# EAGLE design PIDDYBOT_V1 (EAGLE 7.1.0)
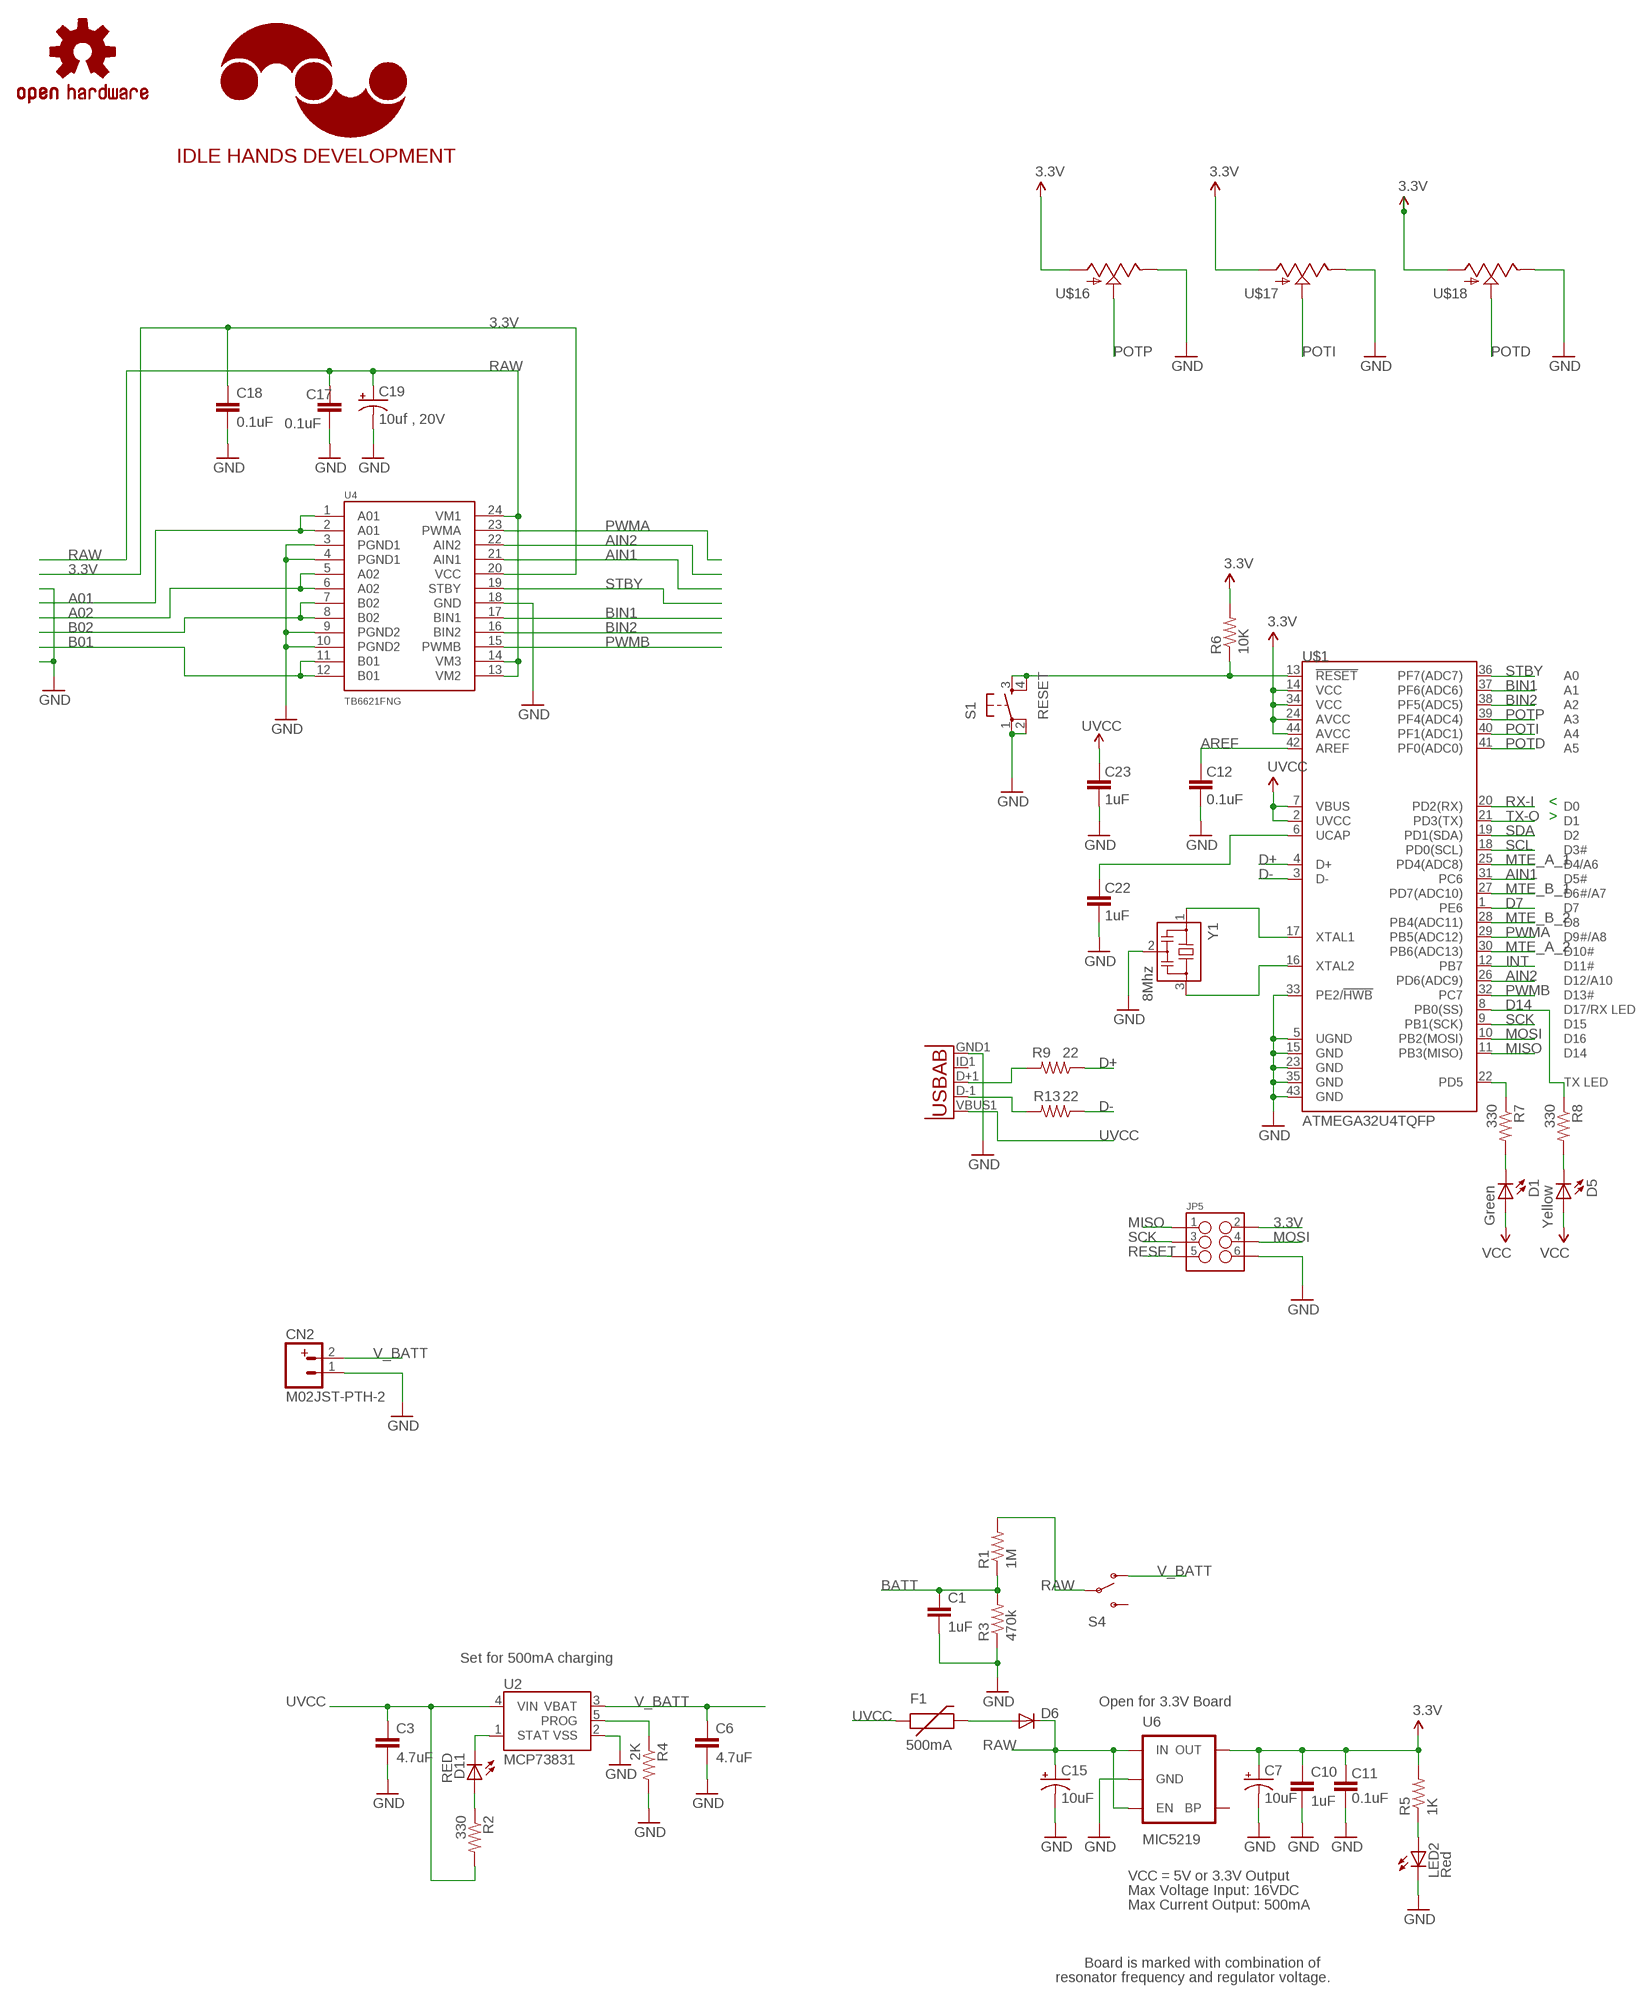
[diagram p0: schematic, sheet 1, part 1 of 2]
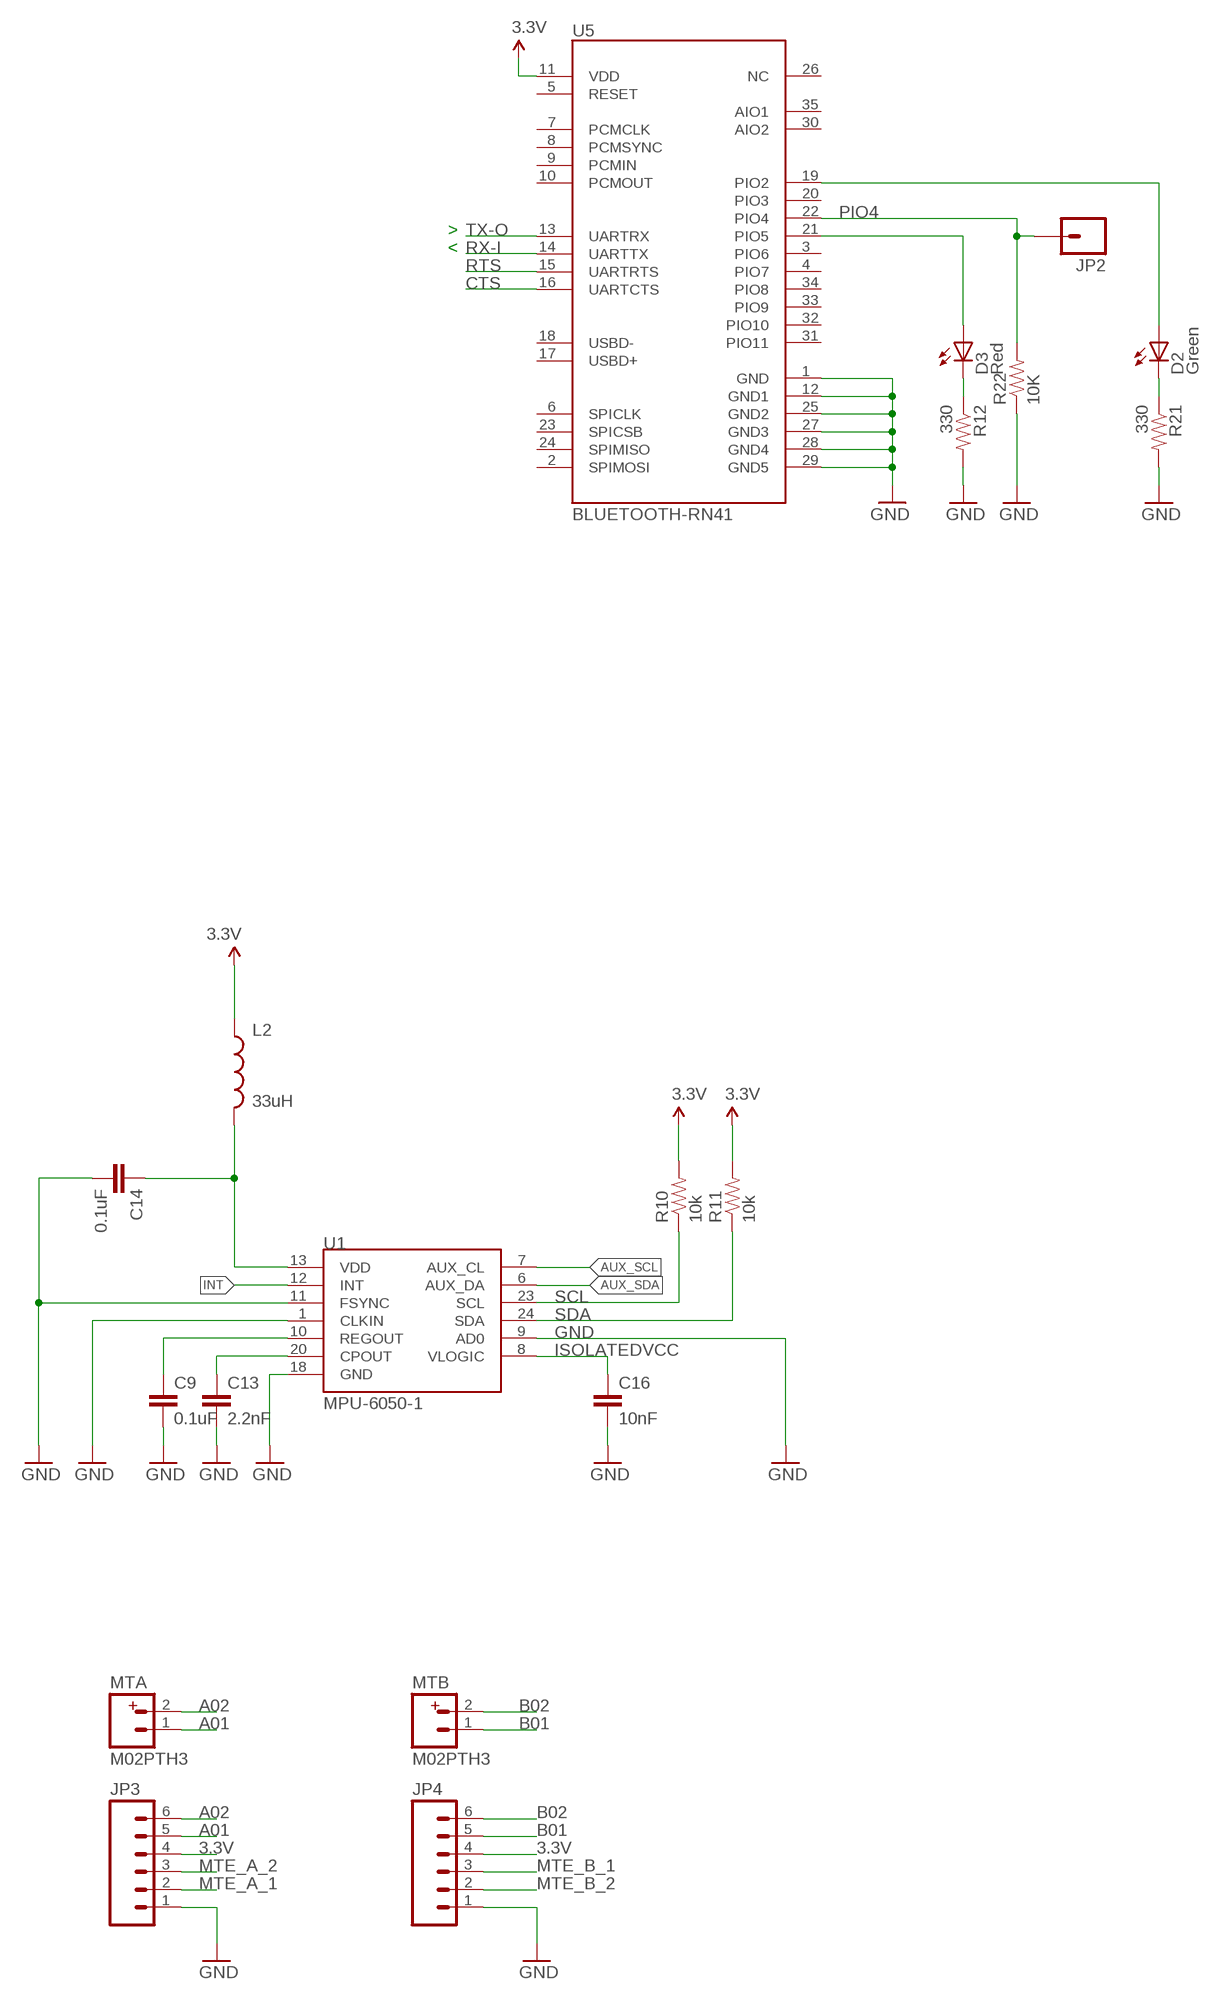
[diagram p1: schematic, sheet 1, part 2 of 2]

## Parts
C1  1uF  CAP0603-CAP  [0603-CAP]
C3  4.7uF  CAP0603-CAP  [0603-CAP]
C6  4.7uF  CAP0603-CAP  [0603-CAP]
C7  10uF  CAP_POL1206  [EIA3216]
C9  0.1uF  CAP0603-CAP  [0603-CAP]
C10  1uF  CAP0603-CAP  [0603-CAP]
C11  0.1uF  CAP0603-CAP  [0603-CAP]
C12  0.1uF  CAP0603-CAP  [0603-CAP]
C13  2.2nF  CAP0603-CAP  [0603-CAP]
C14  0.1uF  CAP0603-CAP  [0603-CAP]
C15  10uF  CAP_POL1206  [EIA3216]
C16  10nF  CAP0603-CAP  [0603-CAP]
C17  0.1uF  CAP0603-CAP  [0603-CAP]
C18  0.1uF  CAP0603-CAP  [0603-CAP]
C19  10uf , 20V  CAP_POL3528  [EIA3528]
C22  1uF  CAP0603-CAP  [0603-CAP]
C23  1uF  CAP0603-CAP  [0603-CAP]
CN2  M02JST-PTH-2  [JST-2-PTH]
D1  Green  LED0603  [LED-0603]
D2  Green  LED0603  [LED-0603]
D3  Red  LED0603  [LED-0603]
D5  Yellow  LED0603  [LED-0603]
D6  DIODESOD  [SOD-323]
D11  RED  LED0603  [LED-0603]
F1  500mA  PTCSMD  [PTC-1206]
JP2  M01SMDNS  [1X01NS]
JP3  M06SMD-1MM  [1X06-1MM]
JP4  M06SMD-1MM  [1X06-1MM]
JP5  M03X2NO_SILK  [2X3-NS]
L2  33uH  INDUCTOR0402  [C0402]
LED2  Red  LED0603  [LED-0603]
LOGO1  IDLEHANDS_LOGOL  [IHD-LOGO-L]
LOGO2  OSHW-LOGOM  [OSHW-LOGO-M]
MTA  M02PTH3  [1X02_LONGPADS]
MTB  M02PTH3  [1X02_LONGPADS]
R1  1M  RESISTOR0603-RES  [0603-RES]
R2  330  RESISTOR0603-RES  [0603-RES]
R3  470k  RESISTOR0603-RES  [0603-RES]
R4  2K  RESISTOR0603-RES  [0603-RES]
R5  1K  RESISTOR0603-RES  [0603-RES]
R6  10K  RESISTOR0603-RES  [0603-RES]
R7  330  RESISTOR0603-RES  [0603-RES]
R8  330  RESISTOR0603-RES  [0603-RES]
R9  22  RESISTOR0603-RES  [0603-RES]
R10  10k  RESISTOR0603-RES  [0603-RES]
R11  10k  RESISTOR0603-RES  [0603-RES]
R12  330  RESISTOR0603-RES  [0603-RES]
R13  22  RESISTOR0603-RES  [0603-RES]
R21  330  RESISTOR0603-RES  [0603-RES]
R22  10K  RESISTOR0603-RES  [0603-RES]
S1  RESET  TAC_SWITCHSMD  [TACTILE_SWITCH_SMD]
S4  SWITCH-SPDTPTH  [SWITCH-SPDT]
U1  MPU-6050-1  [QFN-24-4MM2]
U2  MCP73831  [SOT23-5]
U4  TB6621FNG  [SSOP24]
U5  BLUETOOTH-RN41  BLUETOOTH-RN41"  [RN41]
U6  MIC5219  V_REG_LDOSMD  [SOT23-5]
U$1  ATMEGA32U4TQFP  [SPARKFUN-DIGITALIC_TQFP44]
U$16  POT  [ALPS_POT]
U$17  POT  [ALPS_POT]
U$18  POT  [ALPS_POT]
X2  USB-ABIN&OUT  [USB-AB-MICRO-SMD-V03-IN&OUT]
Y1  8Mhz  CSTCR6M00G53Z  [CSTCR6M]

## Nets
3.3V: C7.A(+) C10.1 C11.2 C18.1 D1.A D5.A JP3.4 JP4.4 JP5.2 L2.1 R5.2 R6.2 R10.2 R11.2 U4.20(VCC) U5.11(VDD) U6.5(OUT) U$1.14(VCC) U$1.24(AVCC) U$1.34(VCC) U$1.44(AVCC) U$16.P$3(A) U$17.P$3(A) U$18.P$3(A) ; supply symbol labelled VCC
A01: JP3.5 MTA.1 U4.1(A01) U4.2(A01)
A02: JP3.6 MTA.2 U4.5(A02) U4.6(A02)
AIN1: U4.21(AIN1) U$1.31(PC6)
AIN2: U4.22(AIN2) U$1.26(PD6(ADC9))
AREF: C12.2 U$1.42(AREF)
AUX_SCL: U1.7(AUX_CL)
AUX_SDA: U1.6(AUX_DA)
B01: JP4.5 MTB.1 U4.11(B01) U4.12(B01)
B02: JP4.6 MTB.2 U4.7(B02) U4.8(B02)
BATT: C1.1 R1.1 R3.2
BIN1: U4.17(BIN1) U$1.37(PF6(ADC6))
BIN2: U4.16(BIN2) U$1.38(PF5(ADC5))
CTS: U5.16(UARTCTS)
D1: D3.C R12.1
D2: D2.C R21.1
D7: U$1.1(PE6)
D14: R8.1 U$1.8(PB0(SS))
D+: R9.1 U$1.4(D+)
D-: R13.1 U$1.3(D-)
GND [vcc]: C1.2 C3.2 C6.2 C7.C(-) C9.2 C10.2 C11.1 C12.1 C13.2 C14.2 C15.C(-) C16.2 C17.2 C18.2 C19.C(-) C22.1 C23.1 CN2.1 JP3.1 JP4.1 JP5.6 LED2.C R3.1 R4.2 R12.2 R21.2 R22.1 S1.1 S1.2 U1.1(CLKIN) U1.9(AD0) U1.11(FSYNC) U1.18(GND) U2.2(VSS) U4.3(PGND1) U4.4(PGND1) U4.9(PGND2) U4.10(PGND2) U4.18(GND) U5.1(GND) U5.12(GND1) U5.25(GND2) U5.27(GND3) U5.28(GND4) U5.29(GND5) U6.2(GND) U$1.5(UGND) U$1.15(GND) U$1.23(GND) U$1.33(PE2/!HWB) U$1.35(GND) U$1.43(GND) U$16.P$1(E) U$17.P$1(E) U$18.P$1(E) X2.GND1(GND) Y1.2
INT: U1.12(INT) U$1.12(PB7)
ISOLATEDVCC: C14.1 C16.1 L2.2 U1.8(VLOGIC) U1.13(VDD)
MISO: JP5.1 U$1.11(PB3(MISO))
MOSI: JP5.4 U$1.10(PB2(MOSI))
MTE_A_1: JP3.2 U$1.25(PD4(ADC8))
MTE_A_2: JP3.3 U$1.30(PB6(ADC13))
MTE_B_1: JP4.3 U$1.27(PD7(ADC10))
MTE_B_2: JP4.2 U$1.28(PB4(ADC11))
N$1: U$1.17(XTAL1) Y1.1
N$2: U$1.16(XTAL2) Y1.3
N$3: D6.2(A) F1.2
N$6: C13.1 U1.20(CPOUT)
N$7: C9.1 U1.10(REGOUT)
N$9: D3.A U5.21(PIO5)
N$11: D2.A U5.19(PIO2)
N$13: D11.A R2.1
N$15: C22.2 U$1.6(UCAP)
N$16: R13.2 X2.D-1(D-)
N$17: R9.2 X2.D+1(D+)
N$19: D5.C R8.2
N$20: D1.C R7.2
N$38: LED2.A R5.1
PIO4: JP2.1 R22.2 U5.22(PIO4)
POTD: U$1.41(PF0(ADC0)) U$18.P$2(S)
POTI: U$1.40(PF1(ADC1)) U$17.P$2(S)
POTP: U$1.39(PF4(ADC4)) U$16.P$2(S)
PROG: R4.1 U2.5(PROG)
PWMA: U4.23(PWMA) U$1.29(PB5(ADC12))
PWMB: U4.15(PWMB) U$1.32(PC7)
RAW: C15.A(+) C17.1 C19.A(+) D6.1(C) R1.2 S4.2(P) U4.13(VM2) U4.14(VM3) U4.24(VM1) U6.1(IN) U6.3(EN)
RESET: JP5.5 R6.1 S1.3 S1.4 U$1.13(!RESET)
RTS: U5.15(UARTRTS)
RX-I: U5.14(UARTTX) U$1.20(PD2(RX))
SCK: JP5.3 U$1.9(PB1(SCK))
SCL: R10.1 U1.23(SCL) U$1.18(PD0(SCL))
SDA: R11.1 U1.24(SDA) U$1.19(PD1(SDA))
STAT: D11.C U2.1(STAT)
STBY: U4.19(STBY) U$1.36(PF7(ADC7))
TX-O: U5.13(UARTRX) U$1.21(PD3(TX))
TXLED: R7.1 U$1.22(PD5)
UVCC: C3.1 C23.2 F1.1 R2.2 U2.4(VIN) U$1.2(UVCC) U$1.7(VBUS) X2.VBUS1(VBUS)
V_BATT: C6.1 CN2.2 S4.1(O) U2.3(VBAT)
Unconnected: S4.3(S) U5.2(SPIMOSI) U5.3(PIO6) U5.4(PIO7) U5.5(RESET) U5.6(SPICLK) U5.7(PCMCLK) U5.8(PCMSYNC) U5.9(PCMIN) U5.10(PCMOUT) U5.17(USBD+) U5.18(USBD-) U5.20(PIO3) U5.23(SPICSB) U5.24(SPIMISO) U5.26(NC) U5.30(AIO2) U5.31(PIO11) U5.32(PIO10) U5.33(PIO9) U5.34(PIO8) U5.35(AIO1) U6.4(BP) X2.ID1(USBID)

## Notes on the sheet
- >
- <
- <
- >
- Set for 500mA charging
- Open for 3.3V Board
- VCC = 5V or 3.3V Output
- Max Voltage Input: 16VDC
- Max Current Output: 500mA
- Board is marked with combination of
- resonator frequency and regulator voltage.

## Library data of the parts
C1 C3 C6 C9-C14 C16-C18 C22 C23 = SparkFun:CAP: Capacitor Standard 0603 ceramic capacitor, and 0.1" leaded capacitor.
C7 C15 C19 = SparkFun:CAP_POL: Capacitor Polarized These are standard SMD and PTH capacitors. Normally 10uF, 47uF, and 100uF in electrolytic and tantalum varieties. Always verify the external diameter of the through hole cap, it varies with capacity, voltage, and manufacturer. The EIA devices should be standard.
CN2 MTA MTB = SparkFun-Connectors:M02: Standard 2-pin 0.1" header. Use with - straight break away headers ( PRT-00116) - right angle break away headers (PRT-00553) - swiss pins (PRT-00743) - machine pins (PRT-00117) - female headers (PRT-00115) Molex polarized connector foot print use with: PRT-08233 with associated crimp pins and housings. 2.54_SCREWTERM for use with PRT-10571. 3.5mm Screw Terminal footprints for PRT-08084 5mm Screw Terminal footprints for use with PRT-08433
D1-D3 D5 D11 LED2 = SparkFun:LED: LEDs Standard schematic elements and footprints for 5mm, 3mm, 1206, and 0603 sized LEDs. 5mm - Spark Fun Electronics SKU : COM-00529 (and others)
D6 = SparkFun:DIODE: Diode These are standard reverse protection diodes and small signal diodes. SMA package can handle up to about 1A. SOD-323 can handle about 200mA. What the SOD-323 package when ordering, there are some mfgs out there that are 5-pin packages.
F1 = SparkFun:PTC: Resettable Fuse PTC Resettable Fuse. Spark Fun Electronics SKU : COM-08357
JP2 = SparkFun:M01: Header 1 Standard 1-pin 0.1" header. Use with straight break away headers (SKU : PRT-00116), right angle break away headers (PRT-00553), swiss pins (PRT-00743), machine pins (PRT-00117), and female headers (PRT-00115).
JP3 JP4 = SparkFun-Connectors:M06: Header 6 Standard 6-pin 0.1" header. Use with straight break away headers (SKU : PRT-00116), right angle break away headers (PRT-00553), swiss pins (PRT-00743), machine pins (PRT-00117), and female headers (PRT-00115). Molex polarized connector foot print use with SKU : PRT-08094 with associated crimp pins and housings. NOTES ON THE VARIANTS LOCK and LOCK_LONGPADS... This footprint was designed to help hold the alignment of a through-hole component (i.e. 6-pin header) while soldering it into place. You may notice that each hole has been shifted either up or down by 0.005 of an inch from it's more standard position (which is a perfectly straight line). This slight alteration caused the pins (the squares in the middle) to touch the edges of the holes. Because they are alternating, it causes a "brace" to hold the component in place. 0.005 has proven to be the perfect amount of "off-center" position when using our standard breakaway headers. Although looks a little odd when you look at the bare footprint, once you have a header in there, the alteration is very hard to notice. Also,if you push a header all the way into place, it is covered up entirely on the bottom side. This idea of altering the position of holes to aid alignment will be further integrated into the Sparkfun Library for other footprints. It can help hold any component with 3 or more connection pins.
JP5 = SparkFun-Connectors:M03X2: 2x3 .1" header. Shrouded, with keying- CONN-10681 SMT- CONN-11415 Pogo pins- HW-11044
L2 = SparkFun-Passives:INDUCTOR: Inductors Basic Inductor/Choke - 0603 and 1206. Footprints are not proven and vary greatly between part numbers. SRN6045- 33uH, 20% 1.4A SDR0403-560KL - 56uH, 10%, 500mA RMS/740mA peak
LOGO1 = IdleHandsProject:IDLEHANDS_LOGO: Open Source Hardware Logo This logo indicates the piece of hardware it is found on incorporates a OSHW license and/or adheres to the definition of open source hardware found here: http://freedomdefined.org/OSHW
LOGO2 = SparkFun-Aesthetics:OSHW-LOGO: Open Source Hardware Logo This logo indicates the piece of hardware it is found on incorporates a OSHW license and/or adheres to the definition of open source hardware found here: http://freedomdefined.org/OSHW
R1-R13 R21 R22 = SparkFun:RESISTOR: Resistor Basic schematic elements and footprints for 0603, 1206, and PTH resistors.
S1 = SparkFun:TAC_SWITCH: Momentary Switch Button commonly used for reset or general input. Spark Fun Electronics SKU : COM-00097
S4 = SparkFun-Electromechanical:SWITCH-SPDT: SPDT Switch Simple slide switch, Spark Fun Electronics SKU : COM-00102 DPDT SMT slide switch, AYZ0202, SWCH-08179
U1 = Testing:MPU-6050
U2 = SparkFun:MCP73831: Microchip's MCP73831 Miniature single cell, fully integrated Li-Ion, Li-polymer charge management controller http://ww1.microchip.com/downloads/en/DeviceDoc/21984a.pdf
U4 = SparkFun:TB6621FNG: Toshiba 1A motor driver
U5 = ScratchPad:BLUETOOTH-RN41
U6 = SparkFun:V_REG_LDO: Voltage Regulator LDO Standard 150mA LDO voltage regulator in SOT-23 layout. Micrel part MIC5205. BP (by-pass) pin is used to lower output noise with 470pF cap.
U$1 = SparkFun-DigitalIC:ATMEGA32U4: Atmel 44-pin 8-bit Microcontroller with 32KBytes of ISP Flash and USB Controller ----- Please use the QFN-44-NOPAD_1:1 package for the footprint of all boards using a 32U4. Route traces directly away from the pads as much as possible.
U$16-U$18 = SparkFun-Electromechanical:POT
X2 = Testing:USB-AB: This is a USB AB connector that is compatible with USB OTG. i.e. this connector can serve as a host or device
Y1 = murata-filter:CSTCR: Resonator Source: murata.co.jp; MPN: CSTCR6M00G53-R0; OC_FARNELL: 1170434; OC_NEWARK: 25M8759

## Net classes
0 default: width 0.203 mm
1 vcc: width 0.254 mm

## Board
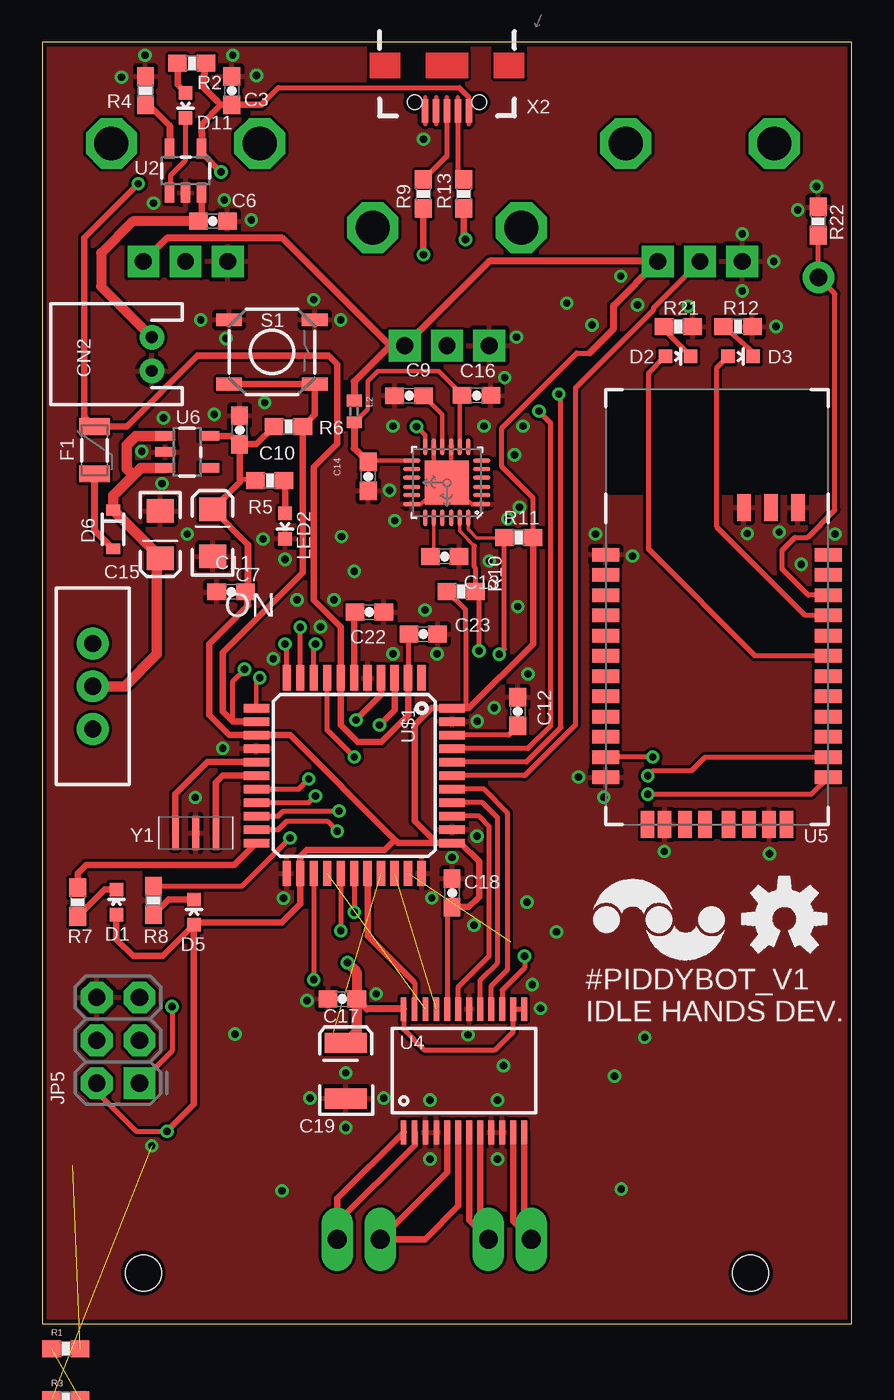
[diagram p2: board, top side]
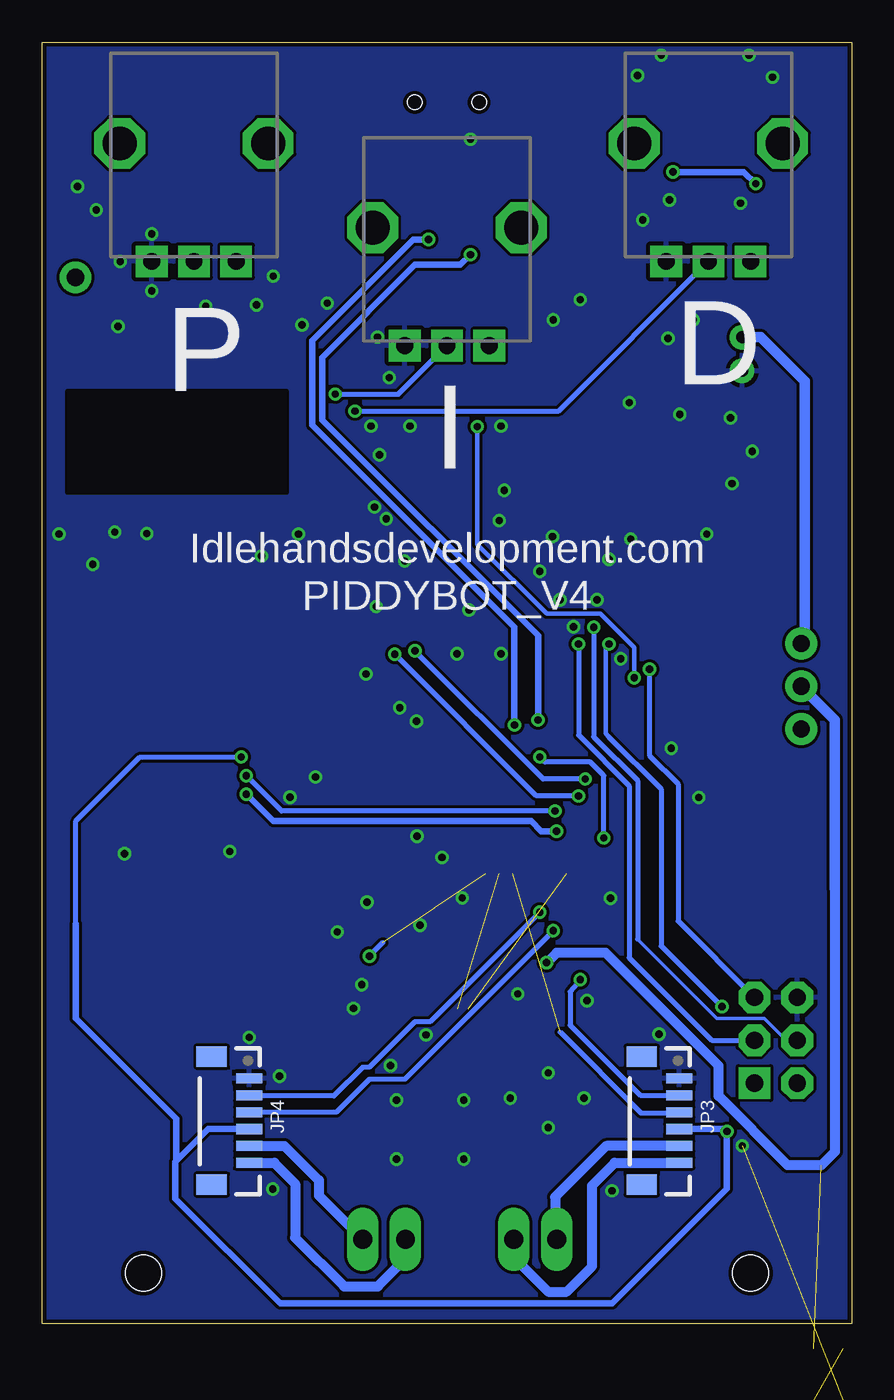
[diagram p3: board, bottom side, seen from below]

Size 48 x 76 mm. Coordinates in mm from the lower left corner, seen from the top.
Outline: 0,0 48,0 48,76 0,76 0,0
Copper layers (1*16): Top 0.0356mm / dielectric 1.5011mm / Bottom 0.0356mm
Design rules "LaenPCBOrder *": minimum track width 7mil, minimum drill 13mil, track to track 7mil, track to pad 7mil, pad to pad 7mil, via to via 7mil, smd to smd 7mil, copper to edge 10mil, drill to drill 7mil, minimum pad ring 7mil, minimum via ring 7mil, stop-mask expansion 3mil, vias tented up to drill 0mil, thermal gap 10mil
Holes 2.11 mm at 6,3 42,3

### Footprints (pad centres in the part's own frame; a part is rotated, then mirrored left to right if it is on the bottom)
0603-CAP = smd 1.1 x 1: 1 -0.85,0; 2 0.85,0
EIA3216 = smd 1.4 x 1.6: A 1.4,0; C -1.4,0
EIA3528 = smd 1.2 x 2.5: A 1.65,0; C -1.65,0
JST-2-PTH = drill 0.7 pad 1.448: 1 -1,0; 2 1,0
LED-0603 = smd 0.8 x 0.8: A 0,-0.75; C 0,0.75
SOD-323 = smd 0.63 x 0.83: 1 -1.15,0; 2 1.15,0
PTC-1206 = smd 1 x 1.8: 1 -1.4,0; 2 1.4,0
1X01NS = drill 1.016 pad 1.88: 1 0,0
1X06-1MM = smd 0.6 x 1.55: 1 -2.54,1.27; 2 -1.54,1.27; 3 -0.54,1.27; 4 0.46,1.27; 5 1.46,1.27; 6 2.46,1.27 | smd 1.2 x 1.8: P$1 -3.84,-0.955; P$2 3.76,-0.955
2X3-NS = drill 1.016 pad 1.88 square: 1 -2.54,-1.27 | drill 1.016 pad 1.88 octagon: 2 -2.54,1.27; 3 0,-1.27; 4 0,1.27; 5 2.54,-1.27; 6 2.54,1.27
C0402 = smd 0.7 x 0.9: 1 -0.65,0; 2 0.65,0
1X02_LONGPADS = drill 1.118 pad 1.88 long: 1 0,0; 2 2.54,0
0603-RES = smd 1.1 x 1: 1 -0.85,0; 2 0.85,0
TACTILE_SWITCH_SMD = smd 1.524 x 0.762: 1 -2.54,1.905; 2 2.54,1.905; 3 -2.54,-1.905; 4 2.54,-1.905
SWITCH-SPDT = drill 1.016 pad 1.88: 1 0,2.54; 2 0,0; 3 0,-2.54
QFN-24-4MM2 = smd 1.016 x 0.254: 1 -2.066,1.257; 2 -2.066,0.75; 3 -2.066,0.247; 4 -2.066,-0.287; 5 -2.066,-0.792; 6 -2.066,-1.297; 13 2.086,-1.297; 14 2.086,-0.792; 15 2.086,-0.287; 16 2.086,0.247; 17 2.086,0.75; 18 2.086,1.257 | smd 0.254 x 1.016: 7 -1.267,-2.122; 8 -0.762,-2.122; 9 -0.258,-2.122; 10 0.278,-2.122; 11 0.78,-2.122; 12 1.287,-2.122; 19 1.287,2.082; 20 0.78,2.082; 21 0.278,2.082; 22 -0.258,2.082; 23 -0.762,2.082; 24 -1.267,2.082 | smd 2.616 x 2.616: P$1 0.02,-0.01
SOT23-5 = smd 0.55 x 1.2: 1 -0.95,-1.3; 2 0,-1.3; 3 0.95,-1.3; 4 0.95,1.3; 5 -0.95,1.3
SSOP24 = smd 0.348 x 1.397: 1 -3.575,-3.656; 2 -2.925,-3.656; 3 -2.275,-3.656; 4 -1.625,-3.656; 5 -0.975,-3.656; 6 -0.325,-3.656; 7 0.325,-3.656; 8 0.975,-3.656; 9 1.625,-3.656; 10 2.275,-3.656; 11 2.925,-3.656; 12 3.575,-3.656; 13 3.575,3.656; 14 2.925,3.656; 15 2.275,3.656; 16 1.625,3.656; 17 0.975,3.656; 18 0.325,3.656; 19 -0.325,3.656; 20 -0.975,3.656; 21 -1.625,3.656; 22 -2.275,3.656; 23 -2.925,3.656; 24 -3.575,3.656
RN41 = smd 0.8 x 1.6: 1 -6.6,-6.6; 2 -5.4,-6.6; 3 -4.2,-6.6; 4 -3,-6.6; 5 -1.8,-6.6; 6 -0.6,-6.6; 7 0.6,-6.6; 8 1.8,-6.6; 9 3,-6.6; 10 4.2,-6.6; 11 5.4,-6.6; 12 6.6,-6.6; 13 6.6,6.6; 14 5.4,6.6; 15 4.2,6.6; 16 3,6.6; 17 1.8,6.6; 18 0.6,6.6; 19 -0.6,6.6; 20 -1.8,6.6; 21 -3,6.6; 22 -4.2,6.6; 23 -5.4,6.6; 24 -6.6,6.6 | smd 1.6 x 0.8: 25 -9.4,4.8; 26 -9.4,3.2; 27 -9.4,1.6; 28 9.4,3.1; 29 9.4,-3.1; 30 9.4,-4.122; 31 9.4,-1.9; 32 9.4,-0.7; 33 9.4,0.7; 34 9.4,1.9; 35 9.4,4.122
SPARKFUN-DIGITALIC_TQFP44 = smd 1.5 x 0.5: 1 -5.8,4; 2 -5.8,3.2; 3 -5.8,2.4; 4 -5.8,1.6; 5 -5.8,0.8; 6 -5.8,0; 7 -5.8,-0.8; 8 -5.8,-1.6; 9 -5.8,-2.4; 10 -5.8,-3.2; 11 -5.8,-4; 23 5.8,-4; 24 5.8,-3.2; 25 5.8,-2.4; 26 5.8,-1.6; 27 5.8,-0.8; 28 5.8,0; 29 5.8,0.8; 30 5.8,1.6; 31 5.8,2.4; 32 5.8,3.2; 33 5.8,4 | smd 0.5 x 1.5: 12 -4,-5.8; 13 -3.2,-5.8; 14 -2.4,-5.8; 15 -1.6,-5.8; 16 -0.8,-5.8; 17 0,-5.8; 18 0.8,-5.8; 19 1.6,-5.8; 20 2.4,-5.8; 21 3.2,-5.8; 22 4,-5.8; 34 4,5.8; 35 3.2,5.8; 36 2.4,5.8; 37 1.6,5.8; 38 0.8,5.8; 39 0,5.8; 40 -0.8,5.8; 41 -1.6,5.8; 42 -2.4,5.8; 43 -3.2,5.8; 44 -4,5.8
ALPS_POT = drill 1 pad 1.88 square: P$1 7,-2.5; P$2 7,0; P$3 7,2.5 | drill 2 octagon: P$4 0,-4.4; P$5 0,4.4
USB-AB-MICRO-SMD-V03-IN&OUT = smd 1.4 x 0.4: D+1 2.7,0; D-1 2.7,0.65; GND1 2.7,-1.3; ID1 2.7,-0.65; VBUS1 2.7,1.3 | hole 0.85: 2.2,1.9; 2.2,-1.9
CSTCR6M = smd 0.4 x 2: 1 -1.2,0; 2 0,0; 3 1.2,0

### Placement (x,y rotation side)
C1  1.4,-7.5 0 top  (outside the outline)
C3  11.25,73.12 90 top
C6  10.12,65.38 0 top
C7  10.1,46.9 90 top
C9  21.75,55.02 180 top
C10  11.7,53 90 top
C11  11.2,43.4 0 top
C12  28.2,36.3 270 top
C13  23.88,45.5 0 top
C14  19.32,50.25 270 top
C15  7,46.8 270 top
C16  25.75,55.05 0 top
C17  17.8,19.25 180 top
C18  24.3,25.55 90 top
C19  18,15 90 top
C22  19.4,42.2 180 top
C23  22.6,40.9 180 top
CN2  6.5,57.5 90 top
D1  4.4,25 0 top
D2  37.7,57.37 270 top
D3  41.4,57.36 270 top
D5  9,24.4 0 top
D6  4.2,47.1 270 top
D11  8.5,72.25 180 top
F1  3.1,51.8 270 top
JP2  46.02,62.05 0 top
JP3  11.5,12 270 bottom
JP4  37,12 270 bottom
JP5  4.5,16.8 90 top
L2  18.5,54.1 270 top
LED2  14.4,47.3 180 top
LOGO1  36.6,24 0 top
LOGO2  44,24 0 top
MTA  17.5,5 0 top
MTB  29,5 180 top
R1  1.4,-1.5 0 top
R2  8.88,74.75 0 top
R3  1.4,-4.5 0 top  (outside the outline)
R4  6.12,73.12 90 top
R5  13.5,50 180 top
R6  14.6,53.2 180 top
R7  2.1,25 270 top
R8  6.6,25.1 270 top
R9  22.6,67 90 top
R10  24.85,43.42 180 top
R11  28.25,46.62 0 top
R12  41.25,59.13 0 top
R13  25,67 90 top
R21  37.71,59.12 0 top
R22  46,65.38 270 top
S1  13.62,57.62 0 top
S4  3,37.8 0 top
U1  24,49.88 180 top
U2  8.5,68.38 0 top
U4  25,15 0 top
U5  40,39 270 top
U6  8.6,51.7 270 top
U$1  18.5,32.5 270 top
U$16  39,70 270 bottom
U$17  24,65 270 bottom
U$18  8.5,70 270 bottom
X2  24,74.62 270 top
Y1  9.1,29.1 180 top

### Tracks (layer width: path | path; a pad name or v marks a point on that pad's centre or on a via)
3.3V  (via drill 0.43)
  Top 0.3: R11.2 29.1,48.98 27.25,50.83 27.25,53.12 31.69,57.56 32.44,57.56 | C18.1 24.02,24.23 U4.20 | v36.2,33.6 U5.11 | v7.4,11.4 5.59,11.4 3.23,13.76 JP5.2 | 25.1,41.2 25.1,36.5
  Top 0.305: 12.7,50.05 11.7,50.05 11.7,49.9 | 25.1,41.2 25.1,42.33 R10.2
  Top 0.4: 13.6,53.05 R6.2 12.7,52.15 C10.1 | U6.5 11.2,52.65 C10.1 | 12.7,50.05 R5.2 | C10.1 11.7,49.9 C7.A 12.2,46.2 | 12.2,42.6 9.9,40.3 9.9,36.1 11.1,34.9 U$1.14 14.7,34.9 20.9,28.7 | 20.9,28.7 21.1,28.5 U$1.34 | D5.A 9.15,23.8 14.2,23.8 15.3,24.9 U$1.24 15.3,27.7 15.7,28.1 20.3,28.1 20.9,28.7 | D1.A 4.4,22.8 5.4,21.8 7.15,21.8 D5.A | D5.A 9,13 v7.4,11.4 | U$1.34 23.4,28.5 22.1,29.8 22.1,35.5 23.1,36.5 U$1.44 25.1,36.5 25.3,36.5 29.1,40.3 R11.2 | U$1.34 24.8,28.5 25.9,27.4 25.9,25.3 25.3,24.7 C18.1
  Top 0.406: 20.62,58 U$17.P$3 26.5,63 U$16.P$3 33.88,60.38 33.88,59 32.44,57.56 | 20.62,58 14.25,64.38 7.38,64.38 U$18.P$3 | 20.62,58 18.5,55.88 L2.1 | 12.2,46.2 12.2,43.55 C11.2 12.2,43.25 12.2,42.6
  Bottom 0.3: 46,23.71 46,29.8 42.2,33.6 v36.2,33.6
  Bottom 0.4: JP3.4 7.54,11.54 v7.4,11.4 7.4,8 14.2,1.2 33.9,1.2 40.1,7.4 40.1,9.6 40.05,9.65 | JP4.4 38.16,11.54 40.05,9.65 | 46,23.71 46,18.1 40.05,12.15 40.05,9.65
A01
  Top 0.4: U4.1 17.5,7.42 MTA.1 17.5,6 22.07,10.57 U4.2
  Bottom 0.6: JP3.5 14.56,10.54 17.59,7.51 17.59,5.09 MTA.1
A02
  Top 0.4: U4.5 24.02,8.98 MTA.2 22.7,5 24.68,6.97 U4.6
  Bottom 0.6: MTA.2 20.04,3.94 18,1.9 16.9,1.9 15.4,3.4 15.4,8.2 14.06,9.54 JP3.6
AIN1  (1 unrouted)
  Top 0.3: 23.4,18.68 U4.21
AIN2  (1 unrouted)
AREF
  Top 0.3: U$1.42 27.65,34.9 C12.2
B01
  Top 0.4: U4.11 27.93,6.08 MTB.1 28.57,5.42 U4.12
  Bottom 0.6: JP4.5 33.64,10.54 31.6,8.5 31.6,7.6 MTB.1
B02
  Top 0.4: U4.8 25.98,5.49 MTB.2 25.32,6.13 U4.7
  Bottom 0.6: JP4.6 34.24,9.54 33,8.3 33,5.1 30.1,2.2 28.1,2.2 26.46,3.84 MTB.2
BATT  (2 unrouted)
BIN1
  Top 0.3: U4.17 25.98,20.38 27,21.4 27,30 26.1,30.9 U$1.37
BIN2
  Top 0.3: U4.16 26.62,20.02 27.6,21 27.6,30.3 26.2,31.7 U$1.38
D1
  Top 0.3: D3.C 42.15,57.59 R12.1
D2
  Top 0.3: D2.C 37.06,58.76 R21.1
D14  (via drill 0.43)
  Top 0.3: R8.1 11.85,25.95 v14.7,28.8 | v18.5,33.6 16.9,35.2 U$1.8
  Bottom 0.3: v14.7,28.8 14.7,32.5 15.5,33.3 18.2,33.3 v18.5,33.6
D+  (via drill 0.43)
  Top 0.4: R9.1 v22.6,63.4 | v18.6,35.8 20.1,37.3 U$1.4
  Bottom 0.4: v22.6,63.4 23.2,62.8 25.9,62.8 31.4,57.3 31.4,53.6 18.6,40.8 v18.6,35.8
D-  (via drill 0.43)
  Top 0.4: R13.1 25,64.4 v25.1,64.3 | v20,35.5 20.9,36.4 U$1.3
  Bottom 0.4: v25.1,64.3 26,64.3 32,58.3 32,53.3 20,41.3 v20,35.5
GND  (via drill 0.43)  (2 unrouted)
  Top 0.254: U1.11 23.22,51.18 23.7,50.7 23.9,50.7 24.26,51.06 U1.9 | 22.8,48.9 22.4,48.6 21.9,48.6 U1.18 | 26.08,48.6 25.5,48.6 25.1,48.9 | 26.1,48.6 26.08,48.6 | 26.08,48.6 U1.1
  other vias: 24.3,27.65 27,9.75 23,9.75 23,13.25 27,13.25 25.25,17.12 20.6,49.42 27.43,56.1 36.88,28 43.12,27.88 28.75,25 15.88,13.38 18,14.88 18,11.62 20.25,13.38 15.7,19.15 28.12,58.5 41.5,64.62 43.38,63 41.5,61.25 17.75,46.67 9.4,59.52 10.9,58.42 16.1,60.73 17.7,59.52 35,45.52 45,45.02 47,46.83 32.8,46.83 31.8,32.42 33.3,31.23 28.8,38.52 26.8,36.52 25.6,23.62 30.5,23.23 29.55,18.7 29.05,20.1 27.35,15.3 6.5,10.55 23.4,39.73 22.7,42.33 20.8,39.73 14.3,25.23 19.8,19.55 8.6,46.83 7.1,49.83 7.2,53.73 12.7,74.03 11.3,75.22 6.1,75.22 4.7,73.92 20.8,53.23 26.2,53.23 31.1,60.52 32.6,59.23 34.3,62.12 35.3,60.42 28.5,53.23 28,51.52 10.2,53.92 13.2,54.62 5.9,51.73 14.4,45.33 13.1,46.52 38.3,60.35 43.5,59.15 44.8,66.05 45.9,67.45 22.6,70.25 6.6,66.45 10.8,66.65 12.4,65.45 35.73,16.98 33.92,14.68 11.43,17.18 9.07,31.2 25.77,28.9 34.33,7.97 14.22,7.88 17.3,42.92 15.1,42.92 25.8,35.73 10.7,34.12 23.1,25.25 28.3,48.42 27.6,47.73 43.7,46.95 41.8,46.85 13.7,39.42 16.5,41.33 18.5,44.62 26.5,45.23 28.2,42.52 20.9,47.62
  pour Top: 0,0 48,0 48,76 0,76
  pour Bottom: 0,0 48,0 48,76 0,76
INT  (via drill 0.43)
  Top 0.254: U1.12 22.71,52.69 v22.2,53.2 | U$1.12 12.7,38.1 v12.9,38.3
  Bottom 0.254: v22.2,53.2 22.2,46.2 18.1,42.1 14.9,42.1 12.9,40.1 v12.9,38.3
ISOLATEDVCC
  Top 0.254: 24.9,55.1 C16.1 24.76,54.91 | 19.4,51.17 U1.13 | 24.76,54.91 24.76,55.24 23.5,56.5 19.9,56.5 19.3,55.9 19.3,54.25 L2.2 | U1.8 24.76,54.91
  Top 0.406: L2.2 18.5,51.92 C14.1
  Top 0.61: 19.4,51.17 C14.1
MISO  (via drill 0.43)
  Top 0.3: U$1.11 14.5,40.2 v14.4,40.3 | v7.7,18.8 7.7,16.19 JP5.1
  Bottom 0.254: v14.4,40.3 14.4,40.2 14.6,40 14.6,35 14.4,34.8
  Bottom 0.3: 14.4,34.8 11.3,31.7 11.3,22.4 v7.7,18.8
MOSI  (via drill 0.43)
  Top 0.3: U$1.10 v15.3,41.3
  Bottom 0.2: JP5.4 3.9,16.8 5.2,18.1 8,18.1 12.7,22.8
  Bottom 0.3: v15.3,41.3 15.3,34.8 12.7,32.2 12.7,22.8
MTE_A_1  (via drill 0.43)
  Top 0.3: U$1.25 v16.1,20.4
  Bottom 0.3: JP3.2 12.54,13.54 16.7,17.7 16.7,19.7 v16.1,20.4
MTE_A_2  (1 unrouted)
  Bottom 0.3: 17.3,17.3 12.5,12.5 10.27,12.5 JP3.3
MTE_B_1  (via drill 0.43)
  Top 0.3: U$1.27 v17.7,23.3
  Bottom 0.3: JP4.3 30.56,12.54 28.6,14.5 26.5,14.5 v17.7,23.3
MTE_B_2  (via drill 0.43)
  Top 0.3: U$1.28 v18.5,24.4
  Bottom 0.3: JP4.2 35.69,13.5 30.7,13.5 29,15.2 28.6,15.2 25.9,17.9 25,17.9 v18.5,24.4
N$1
  Top 0.4: U$1.17 10.7,32.5 10.3,32.1 Y1.1
N$2
  Top 0.4: U$1.16 9.8,33.3 7.9,31.4 Y1.3
N$3
  Top 0.406: F1.2 3.1,47.05 D6.2
N$5
  cutout Bottom: 33.5,55.3 46.5,55.3 46.5,49.3 33.5,49.3
  cutout Top: 33.5,55.3 46.5,55.3 46.5,49.3 33.5,49.3
N$6
  Top 0.2: U1.20 23.22,45.7 C13.1
N$7
  Top 0.254: C9.1 23.72,53.9 U1.10
N$9
  Top 0.3: U5.21 45.25,42 40,47.25 40,56.71 D3.A
N$11
  Top 0.3: U5.19 42.27,39.6 35.95,45.92 35.95,56.37 D2.A
N$13
  Top 0.4: R2.1 8.03,73.47 D11.A
N$15
  Top 0.4: U$1.6 18.5,42.15 C22.2
N$16
  Top 0.3: 24.65,71.12 24.65,68.2 R13.2
  Top 0.4: 24.85,68 R13.2
N$17
  Top 0.3: 24,71.12 24,69.25 R9.2
  Top 0.4: R9.2 22.6,68.22
N$19
  Top 0.4: R8.2 7.5,25.15 D5.C
N$20
  Top 0.4: R7.2 3.7,25.75 D1.C
N$38
  Top 0.4: R5.1 14.4,49.95 LED2.A
PIO4
  Top 0.3: U5.22 45.42,43.2 43.88,44.75 43.88,45.88 44.62,46.62 45.38,46.62 47,48.25 47,61.08 JP2.1 46.02,64.7 R22.2
POTD  (via drill 0.43)
  Top 0.3: v29.45,54.12 30.12,53.45 30.12,35.42 28.8,34.1 U$1.41
  Bottom 0.3: v29.45,54.12 17.38,54.12 U$18.P$2
POTI  (via drill 0.43)
  Top 0.3: 30.62,55 v30.62,55.12 30.75,55 30.75,35.35 28.7,33.3 U$1.40
  Bottom 0.3: v30.62,55.12 26.88,55.12 U$17.P$2
POTP
  Top 0.3: U$16.P$2 36.25,60.25 36.25,60.12 31.62,55.5 31.62,35.52 28.6,32.5 U$1.39
PROG
  Top 0.4: R4.1 6.33,72.28 7.55,71.05
  Top 0.406: 7.55,71.05 U2.5
PWMA
  Top 0.3: 22,20.3 22.07,20.23 U4.23
  Top 0.4: U$1.29 19.3,23 22,20.3
PWMB  (via drill 0.43)  (1 unrouted)
  Top 0.3: v28.6,21.8 28.6,21.1 27.27,19.77 U4.15
  Bottom 0.3: 27.8,22.6 v28.6,21.8
RAW  (via drill 0.43)  (1 unrouted)
  Top 0.305: U4.24 21.43,17.45 22.62,16.25 26.88,16.25 27.93,17.3 U4.14 U4.13
  Top 0.406: U4.24 19.24,18.66 C17.1
  Top 0.6: v18.1,21.4 18.65,20.85 C17.1
  Top 0.61: 5.4,50.3 4.2,49.1 D6.1 7,45.45 C15.A 6.8,45.2 6.8,39.7 4.9,37.8 S4.2 | 5.4,50.3 5.85,50.75 U6.3 | U6.1 5.55,52.65 5,52.1 5,50.7 5.4,50.3 | C17.1 18.65,17.3 C19.A
  Bottom 0.6: 1,25.8 1,10.2 1.8,9.4 3.8,9.4 7.9,13.5 7.9,15.3 14.6,22 17.5,22 v18.1,21.4
  Bottom 0.61: 1,25.8 1,35.8 S4.2
RESET  (via drill 0.43)
  Top 0.3: 11.3,35.7 11.3,38.1 v12,38.8
  Top 0.4: S1.3 S1.4 16.16,53.91 R6.1 15.45,44.55 10.7,39.8 10.7,36.3 11.3,35.7 U$1.13
  Bottom 0.3: v12,38.8 12,33.7 10.3,32 10.3,23.87 JP5.5
RX-I  (via drill 0.43)
  Top 0.3: U$1.20 14,30.1 14.3,30.4 v17.6,30.4 | v35.9,32.5 36.2,32.8 38.5,32.8 39.3,33.6 U5.14
  Bottom 0.3: v17.6,30.4 33.8,30.4 v35.9,32.5
SCK  (via drill 0.43)
  Top 0.3: U$1.9 16.1,40.2 v16.2,40.3
  Bottom 0.3: v16.2,40.3 16.2,34.9 13.2,31.9 13.2,21.7 8.3,16.8 JP5.3
SCL  (via drill 0.43)
  Top 0.2: 25.62,46.12 24.75,47 U1.23
  Top 0.3: 25.62,44.88 25.62,46.12 | U$1.18 15.2,31.7 v15.8,32.3
  Top 0.305: v25.9,39.9 25.9,43.23 R10.1 25.7,44.8 25.62,44.88
  Bottom 0.3: v15.8,32.3 18.3,32.3 v25.9,39.9
SDA  (via drill 0.43)
  Top 0.2: U1.24 25.27,47.11 25.77,46.6 27.38,46.6 R11.1
  Top 0.3: U$1.19 15.8,30.9 v16.2,31.3 | v27.1,39.7 27.4,40 R11.1
  Bottom 0.3: v16.2,31.3 18.7,31.3 v27.1,39.7
STAT
  Top 0.305: U2.1 7.62,67.08 7.62,68.12 8.5,69 D11.C
STBY
  Top 0.3: U4.19 24.68,19.98 26.5,21.8 26.5,29.5 25.9,30.1 U$1.36
TX-O  (via drill 0.43)
  Top 0.3: U$1.21 14,29.3 14.5,29.8 16.9,29.8 v17.5,29.2 | 46.4,32.2 U5.13 45.6,31.4 v35.9,31.4
  Bottom 0.4: v17.5,29.2 18.4,29.2 19,29.8 34.3,29.8 v35.9,31.4
TXLED
  Top 0.4: R7.1 2.1,26.7 2.6,27.2 11.4,27.2 U$1.22
UVCC  (via drill 0.43)
  Top 0.3: 11.43,72.3 C3.1 | C23.2 21.7,40.85 U$1.2 | 13.18,72.47 14,73.3 24.73,73.3 25.3,72.73
  Top 0.4: U2.4 9.45,69.45 v10.6,68.3 | v5.7,67.6 2.5,64.4 2.5,53.8 F1.1 5,53.2 9.2,57.4 17,57.4 17.5,56.9 17.5,52.2 16.1,50.8 16.1,42.9 17.7,41.3 U$1.7 17.7,35.5 18.7,34.5 20.1,34.5 21.7,36.1 U$1.2 | C3.1 10.6,72.28 | 10.6,72.28 10.4,72.47 | 11.43,72.3 13,72.3 13.18,72.47 | 9.45,70.67 9.45,71.12 10.6,72.28
  Top 0.406: 9.45,70.67 U2.4 | 10.4,72.47 9.53,73.35 R2.2
  Bottom 0.4: v10.6,68.3 6.4,68.3 v5.7,67.6
V_BATT
  Top 0.4: 9.47,67.05 9.47,65.58 C6.1
  Top 0.406: U2.3 9.47,67.05
  Top 0.6: C6.1 5.38,65.38 3.5,63.5 3.5,61.5 CN2.2
  Bottom 0.61: CN2.2 5.4,58.5 2.8,55.9 2.8,40.54 S4.1

### Text on the board
tNames: ON | #PIDDYBOT_V1 | IDLE HANDS DEV.
bNames: D | P | I | Idlehandsdevelopment.com | PIDDYBOT_V4